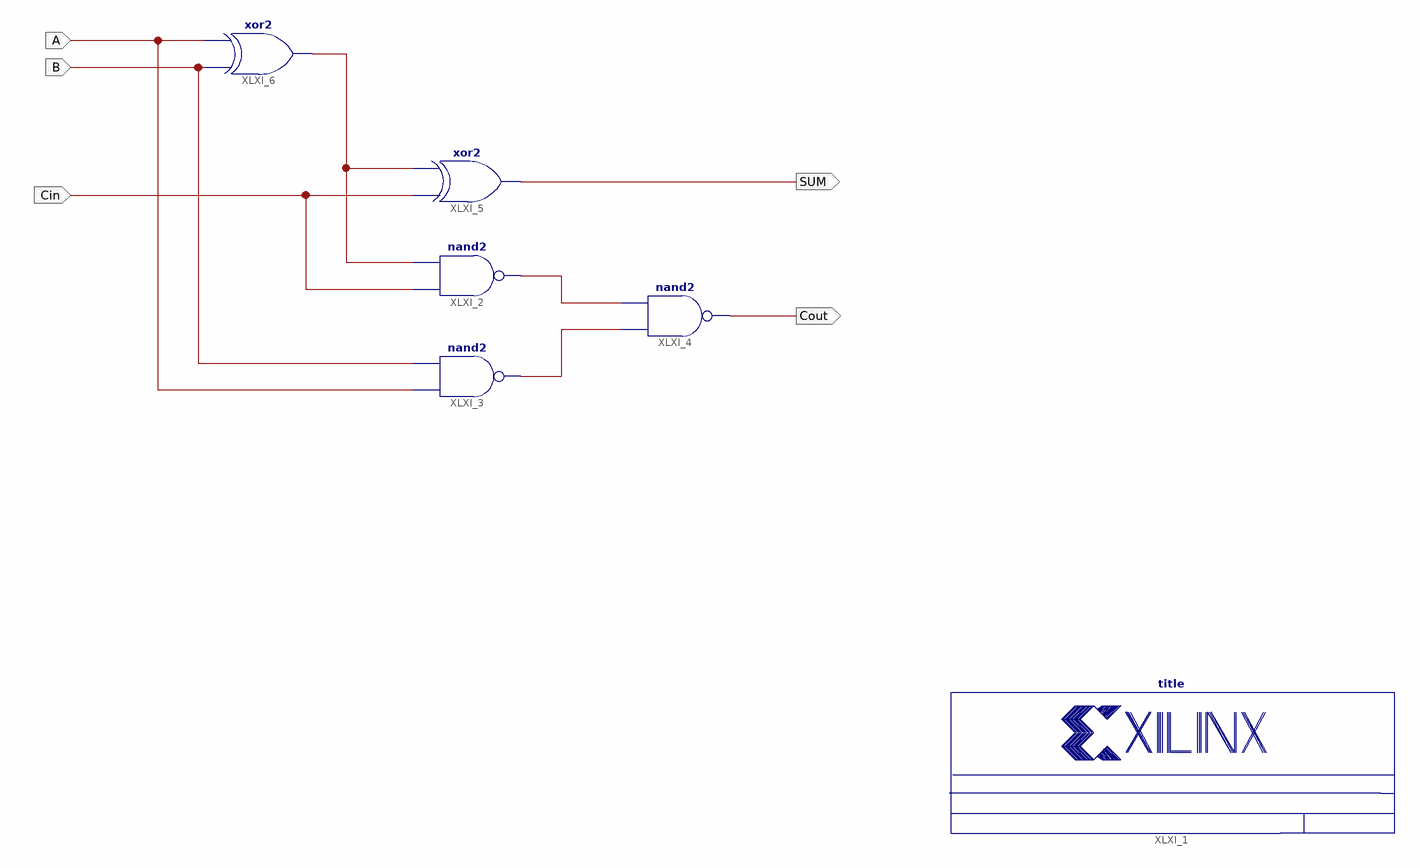
[diagram p0: schematic sheet 1]
// Xilinx ISE schematic fulladd.sch (spartan3e) as structural Verilog: 6 symbols, 5 ports
module fulladd (
  input  Cin,
  input  B,
  input  A,
  output SUM,
  output Cout
);

  wire XLXN_1, XLXN_12, XLXN_13;

  title #(.TitleFieldText("Volladdierer"), .NameFieldText("Mikail Yoelek")) XLXI_1 ();
  nand XLXI_2 (XLXN_13, Cin, XLXN_1);
  nand XLXI_3 (XLXN_12, A, B);
  nand XLXI_4 (Cout, XLXN_12, XLXN_13);
  xor XLXI_5 (SUM, Cin, XLXN_1);
  xor XLXI_6 (XLXN_1, B, A);
endmodule
